# EAGLE design dummy-load - OK (EAGLE 6.1)
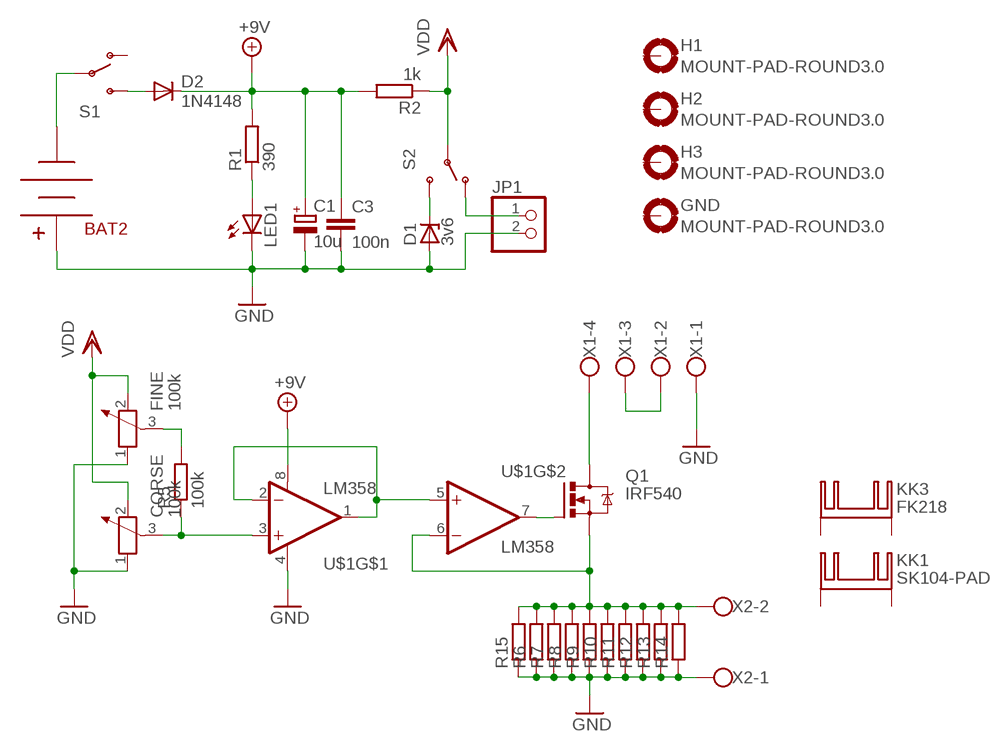
[diagram p0: schematic, sheet 1]

## Parts
BAT2  BC9VPC  [BC9VPC]
C1  10u  CPOL-EUTT2D5L  [TT2D5L]
C3  100n  C-EU025-025X050  [C025-025X050]
CORSE  100k  POTENTIOMETER_PT-10  [PT-10]
D1  3v6  ZENER-DIODEZD-5  [ZDIO-5]
D2  1N4148  DIODE-D-2.5  [D-2.5]
FINE  100k  POTENTIOMETER_PT-10  [PT-10]
GND  MOUNT-PAD-ROUND3.0  [3,0-PAD]
H1  MOUNT-PAD-ROUND3.0  [3,0-PAD]
H2  MOUNT-PAD-ROUND3.0  [3,0-PAD]
H3  MOUNT-PAD-ROUND3.0  [3,0-PAD]
JP1  PINHD-1X2  [1X02]
KK1  SK104-PAD  [SK104-PAD]
KK3  FK218  [FK218]
LED1  LED5MM  [LED5MM]
Q1  IRF540  [TO220BV]
R1  390  R-EU_0207/2V  [0207/2V]
R2  1k  R-EU_0204/7  [0204/7]
R5  100k  R-EU_0204/7  [0204/7]
R6  R-EU_0207/7  [0207/7]
R7  R-EU_0207/7  [0207/7]
R8  R-EU_0207/7  [0207/7]
R9  R-EU_0207/7  [0207/7]
R10  R-EU_0207/7  [0207/7]
R11  R-EU_0207/7  [0207/7]
R12  R-EU_0207/7  [0207/7]
R13  R-EU_0207/7  [0207/7]
R14  R-EU_0207/7  [0207/7]
R15  R-EU_0207/7  [0207/7]
S1  SWITCH-SPSTPTH  [SWITCH-SPDT]
S2  SWITCH-SPSTPTH  [SWITCH-SPDT]
U$1  LM358  [DIP08]
X1  W237-4  [W237-4]
X2  W237-102  [W237-102]

## Nets
+9V: C1.+ C3.1 D2.C R1.2 R2.2 U$1.8(V+)
GND: BAT2.V+ C1.- C3.2 CORSE.1 D1.A FINE.1 JP1.2 LED1.K(C) R6.1 R7.1 R8.1 R9.1 R10.1 R11.1 R12.1 R13.1 R14.1 R15.1 U$1.4(V-) X1.1 X2.1
N$1: U$1.1(OUT) U$1.2(-IN) U$1.5(+IN)
N$2: CORSE.3 R5.1 U$1.3(+IN)
N$3: LED1.A R1.1
N$4: FINE.3 R5.2
N$5: BAT2.V- S1.2(P)
N$6: Q1.D X1.4
N$7: X1.2 X1.3
N$8: D2.A S1.3(S)
N$9: Q1.G U$1.7(OUT)
N$10: D1.C S2.3(S)
N$11: JP1.1 S2.1(O)
N$16: Q1.S R6.2 R7.2 R8.2 R9.2 R10.2 R11.2 R12.2 R13.2 R14.2 R15.2 U$1.6(-IN) X2.2
VDD: CORSE.2 FINE.2 R2.1 S2.2(P)
Unconnected: GND.B3,0(MOUNT) H1.B3,0(MOUNT) H2.B3,0(MOUNT) H3.B3,0(MOUNT) KK1.K1(K) KK1.K2(K) KK3.A2,2(K) KK3.B2,2(K) S1.1(O)

## Library data of the parts
BAT2 = SparkFun-Connectors:BC9VPC: 9V board-mount battery cradle
C1 = rcl:CPOL-EU: POLARIZED CAPACITOR, European symbol
C3 = rcl:C-EU: CAPACITOR, European symbol
CORSE FINE = rcl:POTENTIOMETER_: Potentiometer
D1 = diode:ZENER-DIODE: Z-Diode
D2 = diode:DIODE-: DIODE
GND H1-H3 = holes:MOUNT-PAD-ROUND: MOUNTING PAD, round
JP1 = pinhead:PINHD-1X2: PIN HEADER
KK1 = heatsink:SK104-PAD: HEATSINK manufacturer Fischer/distributor Buerklin
KK3 = heatsink:FK218: HEATSINK manufacturer Fischer/distributor Buerklin
LED1 = adafruit:LED: LED OSRAM: - CHIPLED LG R971, LG N971, LY N971, LG Q971, LY Q971, LO R971, LY R971 LH N974, LH R974 LS Q976, LO Q976, LY Q976 LO Q996 - Hyper CHIPLED LW Q18S LB Q993, LB Q99A, LB R99A - SideLED LS A670, LO A670, LY A670, LG A670, LP A670 LB A673, LV A673, LT A673, LW A673 LH A674 LY A675 LS A676, LA A676, LO A676, LY A676, LW A676 LS A679, LY A679, LG A679 - Hyper Micro SIDELED® LS Y876, LA Y876, LO Y876, LY Y876 LT Y87S - SmartLED LW L88C, LW L88S LB L89C, LB L89S, LG L890 LS L89K, LO L89K, LY L89K LS L896, LA L896, LO L896, LY L896 - TOPLED LS T670, LO T670, LY T670, LG T670, LP T670 LSG T670, LSP T670, LSY T670, LOP T670, LYG T670 LG T671, LOG T671, LSG T671 LB T673, LV T673, LT T673, LW T673 LH T674 LS T676, LA T676, LO T676, LY T676, LB T676, LH T676, LSB T676, LW T676 LB T67C, LV T67C, LT T67C, LS T67K, LO T67K, LY T67K, LW E67C LS E67B, LA E67B, LO E67B, LY E67B, LB E67C, LV E67C, LT E67C LW T67C LS T679, LY T679, LG T679 LS T770, LO T770, LY T770, LG T770, LP T770 LB T773, LV T773, LT T773, LW T773 LH T774 LS E675, LA E675, LY E675, LS T675 LS T776, LA T776, LO T776, LY T776, LB T776 LHGB T686 LT T68C, LB T68C - Hyper Mini TOPLED® LB M676 - Mini TOPLED Santana® LG M470 LS M47K, LO M47K, LY M47K Source: http://www.osram.convergy.de/
Q1 = transistor-power:IRF540: HEXFET Power MOSFET
R1 R2 R5-R15 = rcl:R-EU_: RESISTOR, European symbol
S1 S2 = SparkFun:SWITCH-SPST: SPST Switch Simple slide switch. Spark Fun Electronics SKU : COM-00102
U$1 = SparkFun:LM358
X1 = con-wago-500:W237-4: WAGO SCREW CLAMP; OC_FARNELL: unknown; OC_NEWARK: unknown
X2 = con-wago-500:W237-102: WAGO SCREW CLAMP; MPN: 237-102; OC_FARNELL: unknown; OC_NEWARK: 70K9898

## Board
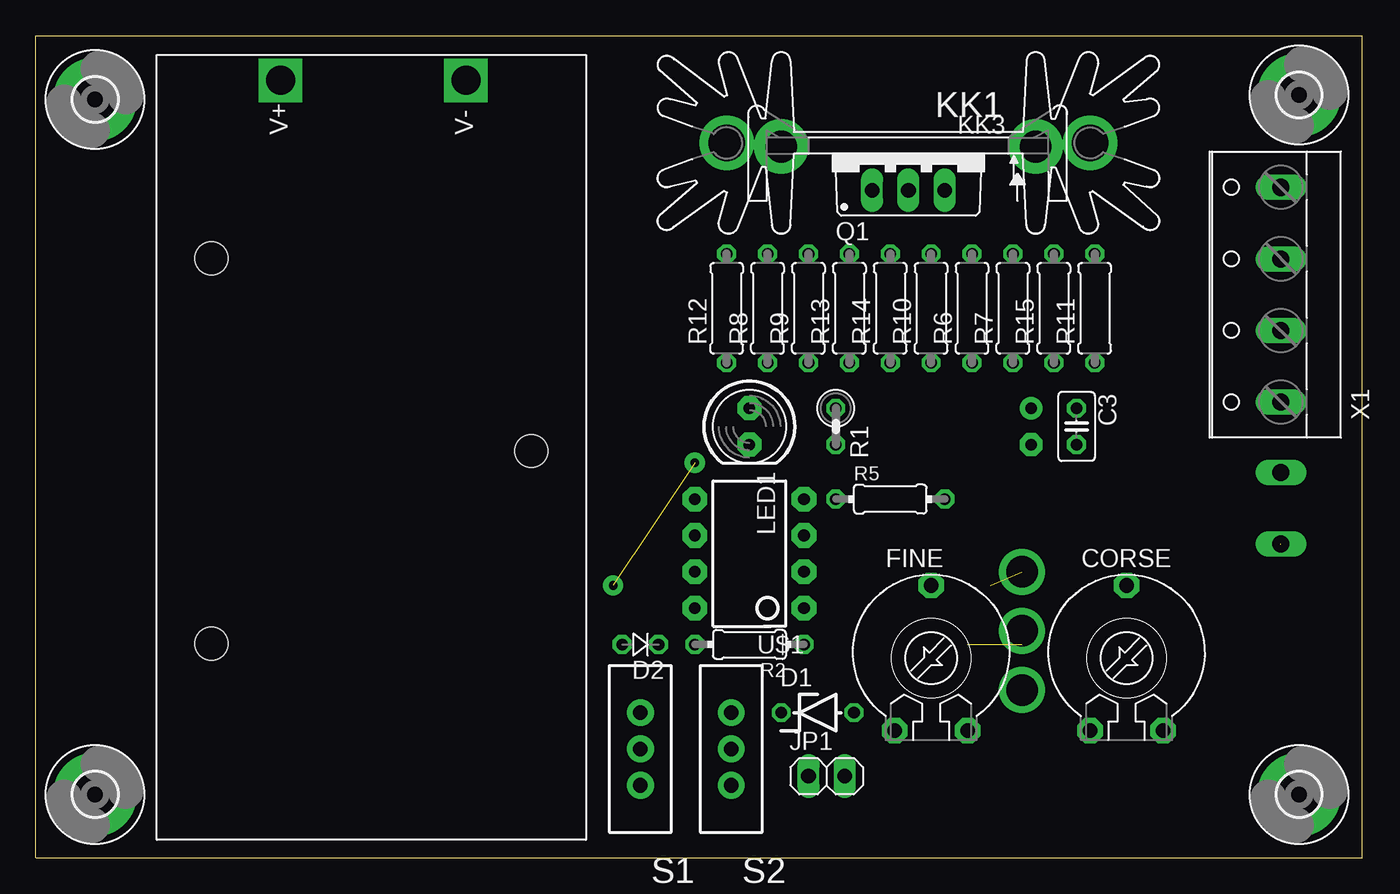
[diagram p1: board, top side]
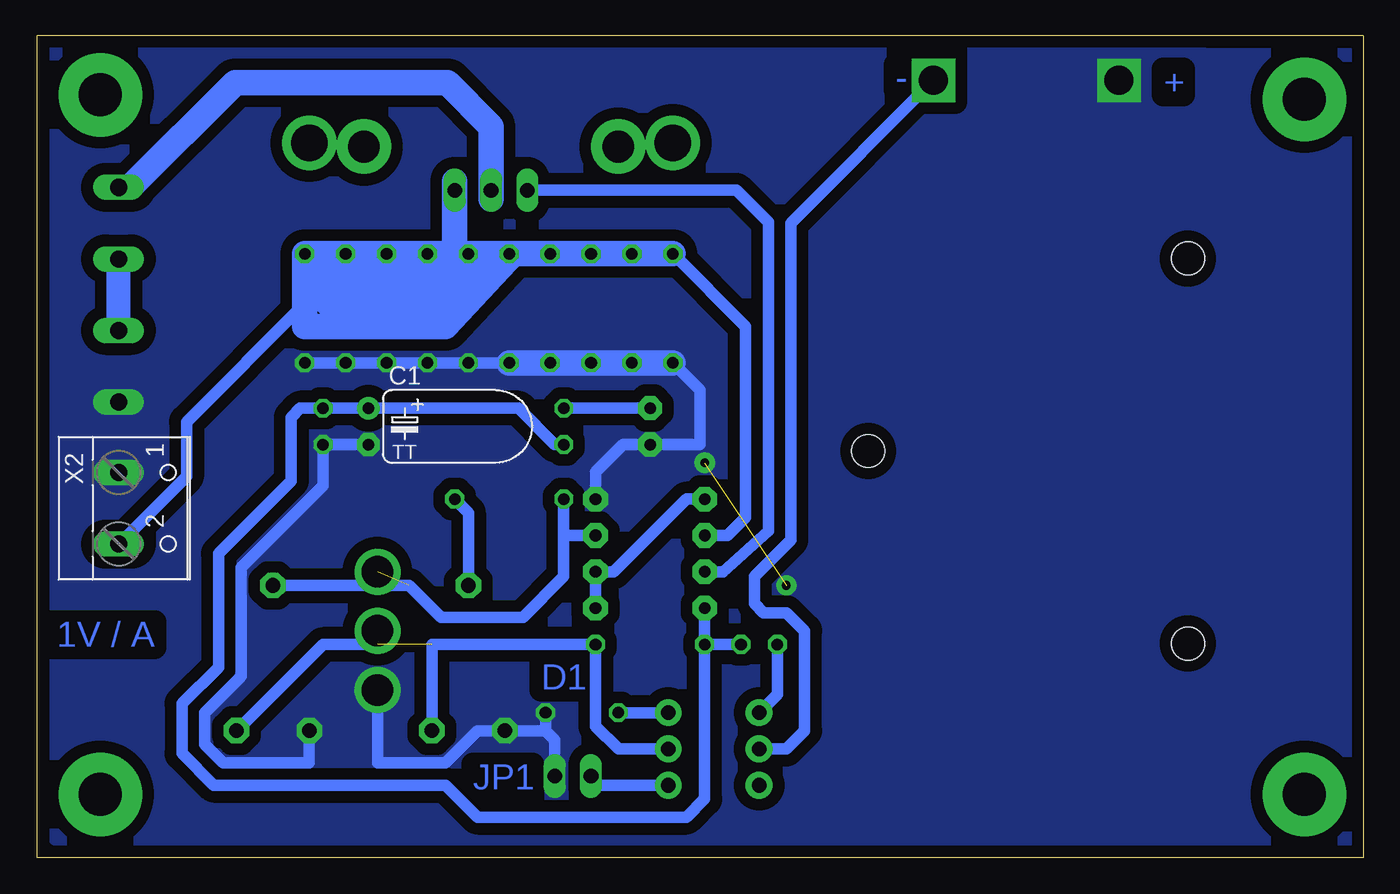
[diagram p2: board, bottom side, seen from below]

Size 92.71 x 57.47 mm. Coordinates in mm from the lower left corner, seen from the top.
Outline: 0.02,0 92.71,0 92.71,57.47 0.02,57.47
Outline: 0,0 0,57.45
Copper layers (1*16): Top 0.035mm / dielectric 1.5mm / Bottom 0.035mm
Design rules: minimum track width 10mil, minimum drill 24mil, track to track 12mil, track to pad 12mil, pad to pad 12mil, via to via 12mil, smd to smd 10mil, copper to edge 12mil, drill to drill 12mil, minimum pad ring 10mil, minimum via ring 10mil, stop-mask expansion 4mil, vias tented up to drill 0mil, thermal gap 12mil

### Footprints (pad centres in the part's own frame; a part is rotated, then mirrored left to right if it is on the bottom)
BC9VPC = drill 2.032 square: V+ 53.086,21.336; V- 53.086,8.382 | hole 2.286: 27.178,3.81; 13.716,26.162; 40.64,26.162
TT2D5L = drill 0.813 pad 1.6: + -1.27,0 | drill 0.813 pad 1.6 octagon: - 1.27,0
C025-025X050 = drill 0.813 octagon: 1 -1.27,0; 2 1.27,0
PT-10 = drill 1.016 pad 1.778 octagon: 1 -2.54,-5.08; 2 2.54,-5.08; 3 0,5.08
ZDIO-5 = drill 0.813 octagon: A 2.54,0; C -2.54,0
D-2.5 = drill 0.813 octagon: A 1.27,0; C -1.27,0
3,0-PAD = drill 3 pad 5.842: B3,0 0,0
1X02 = drill 1.016 long: 1 -1.27,0; 2 1.27,0
SK104-PAD = drill 2.54 pad 3.81: K1 -12.7,-0.762; K2 12.7,-0.762
FK218 = drill 2.21 pad 3.81: A2,2 -8.89,-0.508; B2,2 8.89,-0.508
LED5MM = drill 0.813 pad 1.676 octagon: A -1.27,0; K 1.27,0
TO220BV = drill 1.016 long: D 0,-2.54; G -2.54,-2.54; S 2.54,-2.54
0207/2V = drill 0.813 octagon: 1 -1.27,0; 2 1.27,0
0204/7 = drill 0.813 octagon: 1 -3.81,0; 2 3.81,0
0207/7 = drill 0.813 octagon: 1 -3.81,0; 2 3.81,0
SWITCH-SPDT = drill 1.016 pad 1.88: 1 0,2.54; 2 0,0; 3 0,-2.54
DIP08 = drill 0.813 pad 1.727 octagon: 1 -3.81,-3.81; 2 -1.27,-3.81; 3 1.27,-3.81; 4 3.81,-3.81; 5 3.81,3.81; 6 1.27,3.81; 7 -1.27,3.81; 8 -3.81,3.81
W237-4 = drill 1.194 long: 1 -7.5,-1.27; 2 -2.5,-1.27; 3 2.5,-1.27; 4 7.5,-1.27
W237-102 = drill 1.194 long: 1 -2.5,-1.27; 2 2.5,-1.27

### Placement (x,y rotation side)
BAT2  38.44,1.27 90 top
C1  69.55,30.16 270 bottom
C3  72.73,30.16 270 top
CORSE  76.22,13.97 0 top
D1  54.63,10.16 0 top
D2  42.25,14.92 180 top
FINE  62.57,13.97 0 top
GND  4.15,4.45 0 top
H1  4.15,53.02 0 top
H2  88.28,4.45 0 top
H3  88.28,53.34 0 top
JP1  55.27,5.71 0 top
KK1  60.98,49.21 180 top
KK3  60.98,49.21 180 top
LED1  49.87,30.16 270 top
Q1  60.98,49.21 0 top
R1  55.9,30.16 270 top
R2  49.87,14.92 180 top
R5  59.71,25.08 0 top
R6  65.42,38.42 90 top
R7  68.28,38.42 90 top
R8  51.14,38.42 90 top
R9  54,38.42 90 top
R10  62.57,38.42 90 top
R11  74,38.42 90 top
R12  48.28,38.42 90 top
R13  56.85,38.42 90 top
R14  59.71,38.42 90 top
R15  71.14,38.42 90 top
S1  42.25,7.62 180 top
S2  48.6,7.62 180 top
U$1  49.87,21.27 90 top
X1  85.74,39.37 90 top
X2  85.74,24.45 270 bottom

### Tracks (layer width: path | path; a pad name or v marks a point on that pad's centre or on a via)
+9V
  Bottom 0.813: R2.2 46.06,4.13 47.33,2.86 61.93,2.86 64.16,5.08 80.35,5.08 82.57,7.3 82.57,10.79 80.03,13.34 80.03,21.27 74.95,26.35 74.95,30.8 74.31,31.43 C3.1 C1.+ 59.08,31.43 56.54,28.89 R1.2 | R2.2 U$1.8 | D2.C R2.2
GND  (via drill 0.6 pad 1.42, 2.2)  (1 unrouted)
  Bottom 0.813: R12.1 46.38,32.7 46.38,28.89 LED1.K 51.77,28.89 53.68,26.99 U$1.4 | D1.A 57.17,8.89 | 57.17,8.89 FINE.1 61.93,8.89 64.16,6.67 68.92,6.67 68.92,11.43 | C1.- C3.2 72.73,26.04 78.44,20.32 78.44,12.7 80.98,10.16 80.98,7.94 79.71,6.67 73.68,6.67 CORSE.1 | JP1.2 56.54,8.26 57.17,8.89 | R14.1 R11.1
  Bottom 1.676: R8.1 51.77,34.61
  Bottom 1.778: R14.1 R13.1 R9.1 R8.1 R12.1
  other vias: 40.34,19.05 46.06,27.62 68.92,11.75
  pour Bottom (isolate 0.813, no thermals): 0.97,56.2 91.46,56.52 91.46,1.27 0.97,1.27
N$1
  Bottom 0.813: U$1.5 47.33,25.08 52.41,20 U$1.2 U$1.1
N$2  (via drill 2.2)  (1 unrouted)
  Bottom 0.813: U$1.3 55.9,22.54 | 55.9,22.54 55.9,19.68 58.76,16.83 64.47,16.83 66.69,19.05 CORSE.3 | R5.1 55.9,22.54
  other vias: 68.92,20
N$3
  Bottom 0.813: LED1.A R1.1
N$4
  Bottom 0.813: R5.2 62.57,24.13 FINE.3
N$5
  Bottom 0.813: BAT2.V- 40.03,44.39 40.03,22.23 42.57,19.68 42.57,17.78 41.93,17.14 40.34,17.14 39.07,15.88 39.07,8.89 40.34,7.62 S1.2
N$6
  Bottom 1.778: 60.98,46.04 Q1.D 60.98,51.12 64.03,54.17 78.88,54.17 86.18,46.87 X1.4
N$7
  Bottom 1.676: X1.2 X1.3
N$8
  Bottom 0.813: D2.A 40.98,11.43 S1.3
N$9
  Bottom 0.813: Q1.G 43.84,46.67 41.61,44.45 41.61,22.86 44.79,20 U$1.7
N$10
  Bottom 0.813: S2.3 D1.C
N$11
  Bottom 0.813: S2.1 54,5.08 JP1.1
N$15
  Bottom 1.778: 59.39,42.23 64.16,37.15 74,37.15 74,42.23
N$16  (1 unrouted)
  Bottom 0.813: R11.2 74,38.73 82.25,30.48 82.25,26.67 87.02,21.91 | U$1.6 44.47,22.54 43.2,23.81 43.2,37.15 R12.2
  Bottom 1.676: 63.52,42.23 R6.2 R7.2 | R12.2 R8.2 R9.2 R13.2 | 68.6,42.23 R15.2 R11.2
  Bottom 1.778: 63.52,42.23 Q1.S 63.52,47.31 | R11.2 68.6,42.23 R7.2 63.52,42.23 | R12.2 R13.2 R14.2 R10.2 63.52,42.23
N$17
  Bottom 1.778: 61.62,40.96 62.89,40.64 64.47,38.73 72.41,38.73 72.41,40.96 64.16,40.96 65.11,40.01 71.46,40.01
VDD  (via drill 2.2)  (1 unrouted)
  Bottom 0.813: S2.2 52.09,7.62 53.68,9.21 R2.1 65.11,14.92 FINE.2 | CORSE.2 72.73,14.92 68.92,14.92 v68.92,15.88

### Text on the board
Bottom: - | + | 9V Battery | 1V / A | http://goo.gl/NwF6Gt | max. 3A (or Z-voltage of D1 / JP1) | Dummy Load | D1 | JP1